# EAGLE schematic CPU (EAGLE 8.2.1)
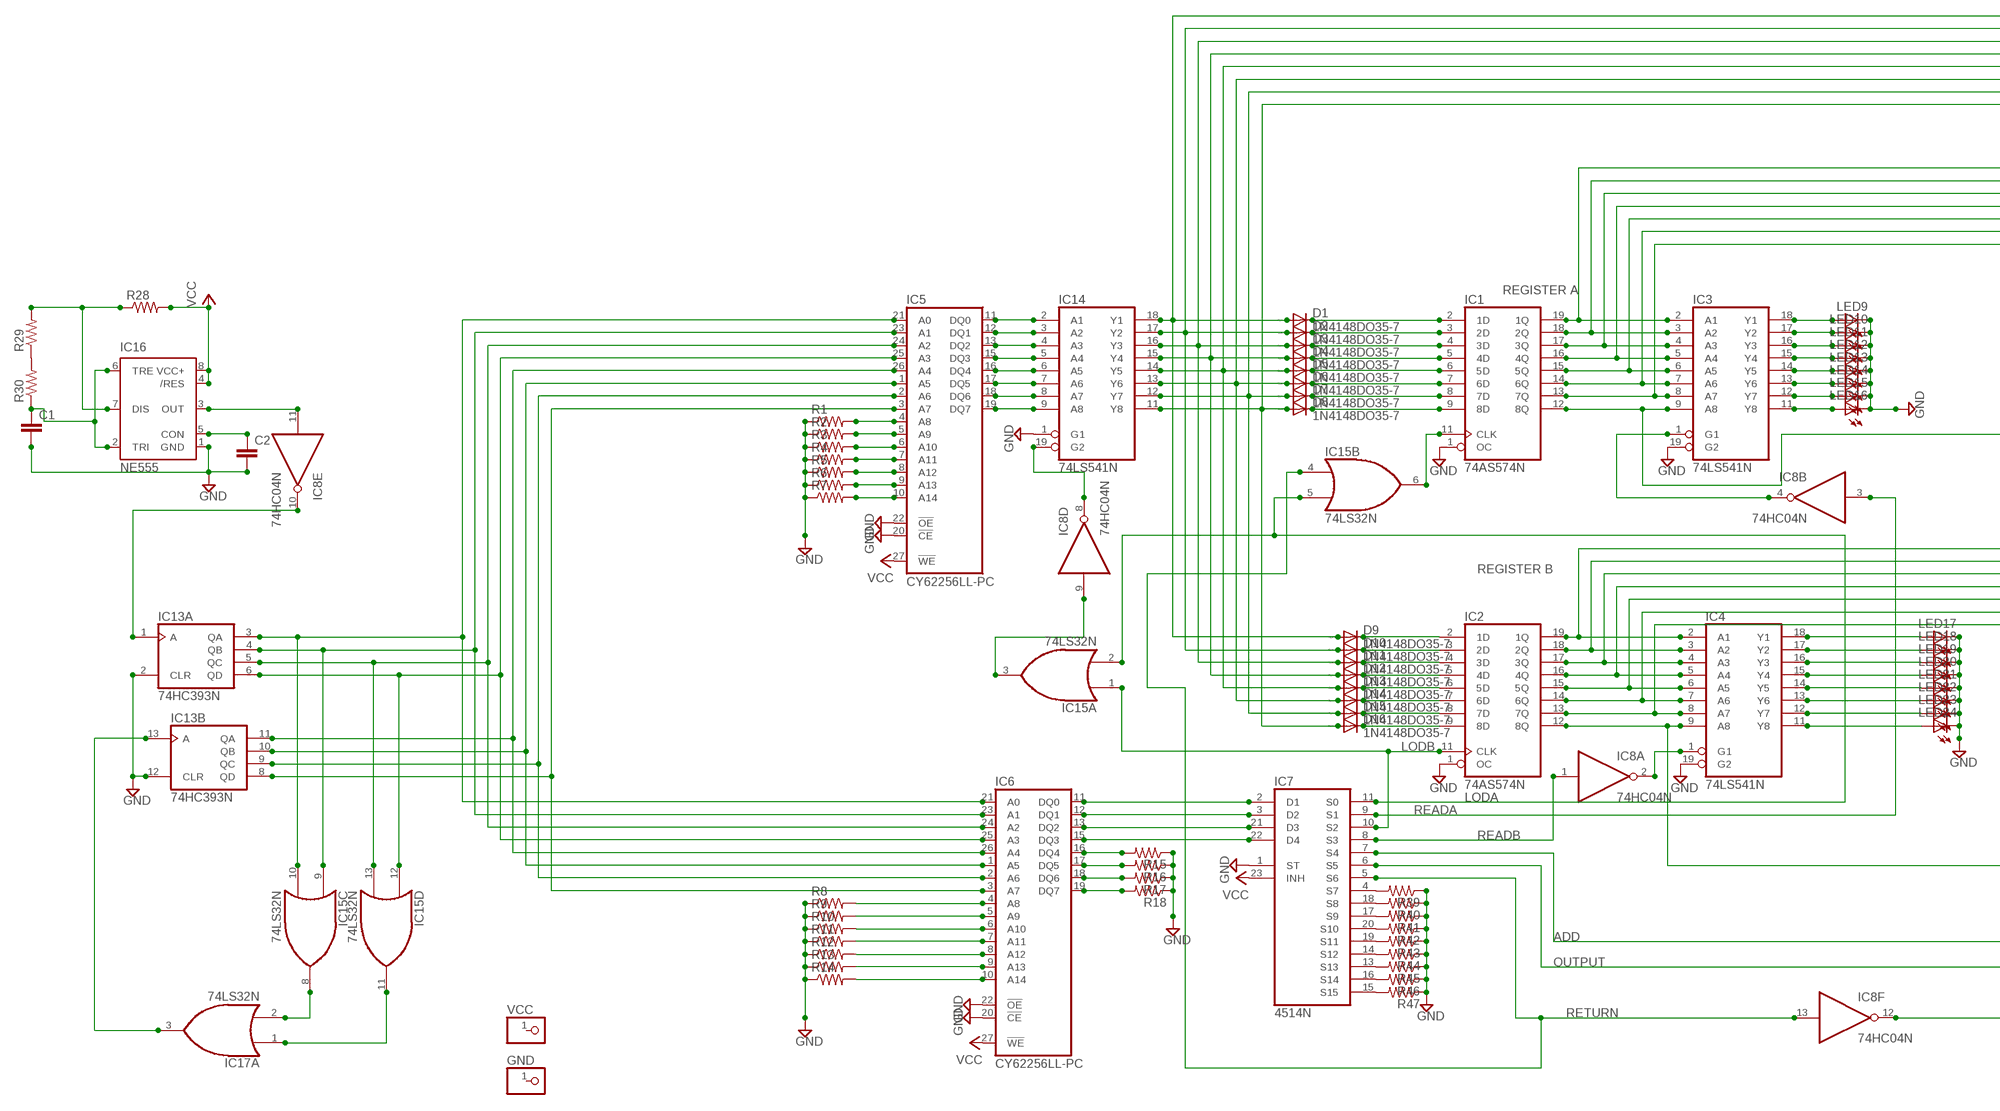
[diagram p0: schematic, sheet 1, part 1 of 2]
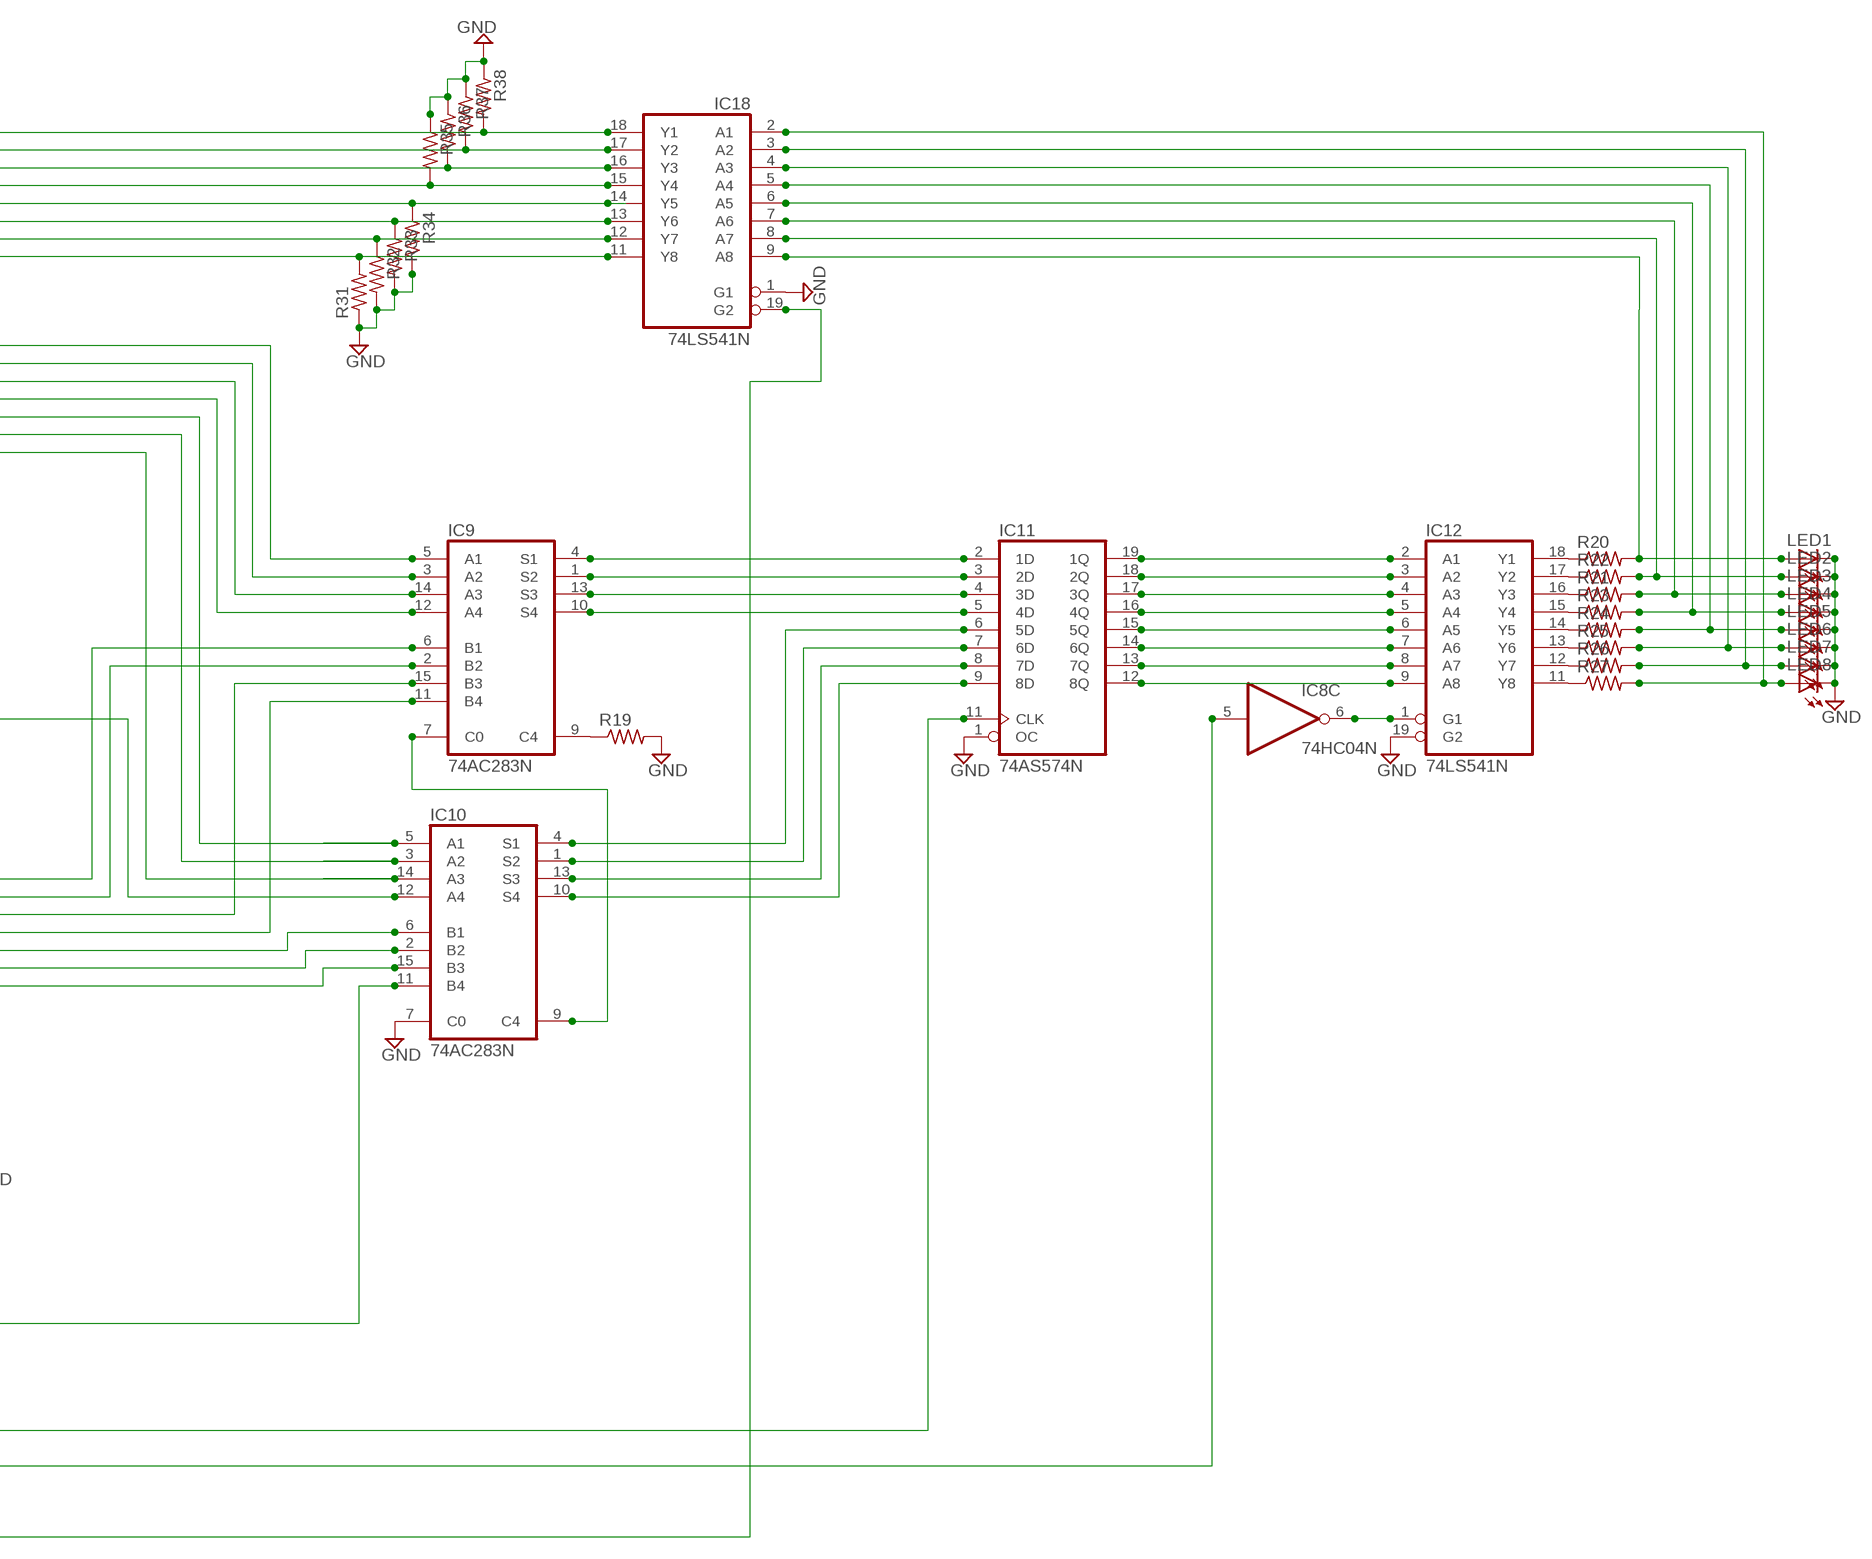
[diagram p1: schematic, sheet 1, part 2 of 2]

## Parts
C1  C2,5-3  [C2.5-3]
C2  C2,5-3  [C2.5-3]
D1  1N4148DO35-7  [DO35-7]
D2  1N4148DO35-7  [DO35-7]
D3  1N4148DO35-7  [DO35-7]
D4  1N4148DO35-7  [DO35-7]
D5  1N4148DO35-7  [DO35-7]
D6  1N4148DO35-7  [DO35-7]
D7  1N4148DO35-7  [DO35-7]
D8  1N4148DO35-7  [DO35-7]
D9  1N4148DO35-7  [DO35-7]
D10  1N4148DO35-7  [DO35-7]
D11  1N4148DO35-7  [DO35-7]
D12  1N4148DO35-7  [DO35-7]
D13  1N4148DO35-7  [DO35-7]
D14  1N4148DO35-7  [DO35-7]
D15  1N4148DO35-7  [DO35-7]
D16  1N4148DO35-7  [DO35-7]
GND  PINHD-1X1  [1X01]
IC1  74AS574N  [DIL20]
IC2  74AS574N  [DIL20]
IC3  74LS541N  [DIL20]
IC4  74LS541N  [DIL20]
IC5  CY62256LL-PC  [DIL28-6]
IC6  CY62256LL-PC  [DIL28-6]
IC7  4514N  [DIL24-6]
IC8  74HC04N  [DIL14]
IC9  74AC283N  [DIL16]
IC10  74AC283N  [DIL16]
IC11  74AS574N  [DIL20]
IC12  74LS541N  [DIL20]
IC13  74HC393N  [DIL14]
IC14  74LS541N  [DIL20]
IC15  74LS32N  [DIL14]
IC16  NE555  [DIL-08]
IC17  74LS32N  [DIL14]
IC18  74LS541N  [DIL20]
LED1  LED3MM  [LED3MM]
LED2  LED3MM  [LED3MM]
LED3  LED3MM  [LED3MM]
LED4  LED3MM  [LED3MM]
LED5  LED3MM  [LED3MM]
LED6  LED3MM  [LED3MM]
LED7  LED3MM  [LED3MM]
LED8  LED3MM  [LED3MM]
LED9  LED3MM  [LED3MM]
LED10  LED3MM  [LED3MM]
LED11  LED3MM  [LED3MM]
LED12  LED3MM  [LED3MM]
LED13  LED3MM  [LED3MM]
LED14  LED3MM  [LED3MM]
LED15  LED3MM  [LED3MM]
LED16  LED3MM  [LED3MM]
LED17  LED3MM  [LED3MM]
LED18  LED3MM  [LED3MM]
LED19  LED3MM  [LED3MM]
LED20  LED3MM  [LED3MM]
LED21  LED3MM  [LED3MM]
LED22  LED3MM  [LED3MM]
LED23  LED3MM  [LED3MM]
LED24  LED3MM  [LED3MM]
R1  R-US_MELF0102AX  [MINI_MELF-0102AX]
R2  R-US_MELF0102AX  [MINI_MELF-0102AX]
R3  R-US_MELF0102AX  [MINI_MELF-0102AX]
R4  R-US_MELF0102AX  [MINI_MELF-0102AX]
R5  R-US_MELF0102AX  [MINI_MELF-0102AX]
R6  R-US_MELF0102AX  [MINI_MELF-0102AX]
R7  R-US_MELF0102AX  [MINI_MELF-0102AX]
R8  R-US_MELF0102AX  [MINI_MELF-0102AX]
R9  R-US_MELF0102AX  [MINI_MELF-0102AX]
R10  R-US_MELF0102AX  [MINI_MELF-0102AX]
R11  R-US_MELF0102AX  [MINI_MELF-0102AX]
R12  R-US_MELF0102AX  [MINI_MELF-0102AX]
R13  R-US_MELF0102AX  [MINI_MELF-0102AX]
R14  R-US_MELF0102AX  [MINI_MELF-0102AX]
R15  R-US_MELF0102AX  [MINI_MELF-0102AX]
R16  R-US_MELF0102AX  [MINI_MELF-0102AX]
R17  R-US_MELF0102AX  [MINI_MELF-0102AX]
R18  R-US_MELF0102AX  [MINI_MELF-0102AX]
R19  R-US_MELF0102AX  [MINI_MELF-0102AX]
R20  R-US_MELF0102AX  [MINI_MELF-0102AX]
R21  R-US_MELF0102AX  [MINI_MELF-0102AX]
R22  R-US_MELF0102AX  [MINI_MELF-0102AX]
R23  R-US_MELF0102AX  [MINI_MELF-0102AX]
R24  R-US_MELF0102AX  [MINI_MELF-0102AX]
R25  R-US_MELF0102AX  [MINI_MELF-0102AX]
R26  R-US_MELF0102AX  [MINI_MELF-0102AX]
R27  R-US_MELF0102AX  [MINI_MELF-0102AX]
R28  R-US_MELF0102AX  [MINI_MELF-0102AX]
R29  R-US_MELF0102AX  [MINI_MELF-0102AX]
R30  R-US_MELF0102AX  [MINI_MELF-0102AX]
R31  R-US_MELF0102AX  [MINI_MELF-0102AX]
R32  R-US_MELF0102AX  [MINI_MELF-0102AX]
R33  R-US_MELF0102AX  [MINI_MELF-0102AX]
R34  R-US_MELF0102AX  [MINI_MELF-0102AX]
R35  R-US_MELF0102AX  [MINI_MELF-0102AX]
R36  R-US_MELF0102AX  [MINI_MELF-0102AX]
R37  R-US_MELF0102AX  [MINI_MELF-0102AX]
R38  R-US_MELF0102AX  [MINI_MELF-0102AX]
R39  R-US_MELF0102AX  [MINI_MELF-0102AX]
R40  R-US_MELF0102AX  [MINI_MELF-0102AX]
R41  R-US_MELF0102AX  [MINI_MELF-0102AX]
R42  R-US_MELF0102AX  [MINI_MELF-0102AX]
R43  R-US_MELF0102AX  [MINI_MELF-0102AX]
R44  R-US_MELF0102AX  [MINI_MELF-0102AX]
R45  R-US_MELF0102AX  [MINI_MELF-0102AX]
R46  R-US_MELF0102AX  [MINI_MELF-0102AX]
R47  R-US_MELF0102AX  [MINI_MELF-0102AX]
VCC  PINHD-1X1  [1X01]

## Nets
GND: C1.2 C2.2 IC1.1(OC) IC2.1(OC) IC3.19(G2) IC4.19(G2) IC5.20(!CE) IC5.22(!OE) IC6.20(!CE) IC6.22(!OE) IC7.1(ST) IC10.7(C0) IC11.1(OC) IC12.19(G2) IC13.2(A:CLR) IC13.12(B:CLR) IC14.1(G1) IC16.1(GND) IC18.1(G1) LED1.K(C) LED2.K(C) LED3.K(C) LED4.K(C) LED5.K(C) LED6.K(C) LED7.K(C) LED8.K(C) LED9.K(C) LED10.K(C) LED11.K(C) LED12.K(C) LED13.K(C) LED14.K(C) LED15.K(C) LED16.K(C) LED17.K(C) LED18.K(C) LED19.K(C) LED20.K(C) LED21.K(C) LED22.K(C) LED23.K(C) LED24.K(C) R1.1 R2.1 R3.1 R4.1 R5.1 R6.1 R7.1 R8.1 R9.1 R10.1 R11.1 R12.1 R13.1 R14.1 R15.1 R16.1 R17.1 R18.1 R19.2 R31.1 R32.2 R33.2 R34.2 R35.1 R36.1 R37.1 R38.1 R39.1 R40.1 R41.1 R42.1 R43.1 R44.1 R45.1 R46.1 R47.1
N$1: IC1.19(1Q) IC3.2(A1) IC9.5(A1)
N$2: IC1.18(2Q) IC3.3(A2) IC9.3(A2)
N$3: IC1.17(3Q) IC3.4(A3) IC9.14(A3)
N$4: IC1.16(4Q) IC3.5(A4) IC9.12(A4)
N$5: IC1.15(5Q) IC3.6(A5) IC10.5(A1)
N$6: IC1.14(6Q) IC3.7(A6) IC10.3(A2)
N$7: IC1.13(7Q) IC3.8(A7) IC10.14(A3)
N$8: IC2.19(1Q) IC4.2(A1) IC9.6(B1)
N$9: IC2.18(2Q) IC4.3(A2) IC9.2(B2)
N$10: IC2.17(3Q) IC4.4(A3) IC9.15(B3)
N$11: IC2.16(4Q) IC4.5(A4) IC9.11(B4)
N$12: IC2.15(5Q) IC4.6(A5) IC10.6(B1)
N$13: IC2.14(6Q) IC4.7(A6) IC10.2(B2)
N$14: IC2.13(7Q) IC4.8(A7) IC10.15(B3)
N$15: IC2.12(8Q) IC4.9(A8) IC10.11(B4)
N$16: IC1.12(8Q) IC3.9(A8) IC10.12(A4)
N$17: IC5.1(A5) IC6.1(A5) IC13.10(B:QB)
N$18: C2.1 IC16.5(CON)
N$19: IC5.23(A1) IC6.23(A1) IC13.4(A:QB) IC15.9(C:I0)
N$20: IC5.24(A2) IC6.24(A2) IC13.5(A:QC) IC15.13(D:I1)
N$21: IC5.25(A3) IC6.25(A3) IC13.6(A:QD) IC15.12(D:I0)
N$22: IC5.26(A4) IC6.26(A4) IC13.11(B:QA)
N$23: IC5.2(A6) IC6.2(A6) IC13.9(B:QC)
N$24: IC5.3(A7) IC6.3(A7) IC13.8(B:QD)
N$25: IC5.11(DQ0) IC14.2(A1)
N$26: IC5.12(DQ1) IC14.3(A2)
N$27: IC5.13(DQ2) IC14.4(A3)
N$28: IC5.15(DQ3) IC14.5(A4)
N$29: IC5.16(DQ4) IC14.6(A5)
N$30: IC5.17(DQ5) IC14.7(A6)
N$31: IC5.18(DQ6) IC14.8(A7)
N$32: IC5.19(DQ7) IC14.9(A8)
N$33: IC5.4(A8) R1.2
N$34: IC5.5(A9) R2.2
N$35: IC5.6(A10) R3.2
N$36: IC5.7(A11) R4.2
N$37: IC5.8(A12) R5.2
N$38: IC5.9(A13) R6.2
N$39: IC5.10(A14) R7.2
N$40: IC6.11(DQ0) IC7.2(D1)
N$41: IC6.4(A8) R8.2
N$42: IC6.5(A9) R9.2
N$43: IC6.6(A10) R10.2
N$44: IC6.7(A11) R11.2
N$45: IC6.8(A12) R12.2
N$46: IC6.9(A13) R13.2
N$47: IC6.10(A14) R14.2
N$48: IC6.12(DQ1) IC7.3(D2)
N$49: IC6.13(DQ2) IC7.21(D3)
N$50: IC6.15(DQ3) IC7.22(D4)
N$51: IC6.16(DQ4) R15.2
N$52: IC6.17(DQ5) R16.2
N$53: IC6.18(DQ6) R17.2
N$54: IC6.19(DQ7) R18.2
N$55: D9.C IC2.2(1D)
N$56: D10.C IC2.3(2D)
N$57: D11.C IC2.4(3D)
N$58: D12.C IC2.5(4D)
N$59: D13.C IC2.6(5D)
N$60: D14.C IC2.7(6D)
N$61: D15.C IC2.8(7D)
N$62: IC5.21(A0) IC6.21(A0) IC13.3(A:QA) IC15.10(C:I1)
N$63: IC7.7(S4) IC11.11(CLK)
N$64: IC2.11(CLK) IC7.10(S2) IC15.1(A:I0)
N$65: IC7.11(S0) IC15.2(A:I1) IC15.5(B:I1)
N$66: IC7.9(S1) IC8.3(B:I)
N$67: IC3.1(G1) IC8.4(B:O)
N$68: IC4.1(G1) IC8.2(A:O)
N$69: IC7.8(S3) IC8.1(A:I)
N$70: IC9.7(C0) IC10.9(C4)
N$71: IC9.9(C4) R19.1
N$72: IC9.4(S1) IC11.2(1D)
N$73: IC9.1(S2) IC11.3(2D)
N$74: IC9.13(S3) IC11.4(3D)
N$75: IC9.10(S4) IC11.5(4D)
N$76: IC10.4(S1) IC11.6(5D)
N$77: IC10.1(S2) IC11.7(6D)
N$78: IC10.13(S3) IC11.8(7D)
N$79: IC10.10(S4) IC11.9(8D)
N$80: IC11.19(1Q) IC12.2(A1)
N$81: IC11.18(2Q) IC12.3(A2)
N$82: IC11.17(3Q) IC12.4(A3)
N$83: IC11.16(4Q) IC12.5(A4)
N$84: IC11.15(5Q) IC12.6(A5)
N$85: IC11.14(6Q) IC12.7(A6)
N$86: IC11.13(7Q) IC12.8(A7)
N$87: IC11.12(8Q) IC12.9(A8)
N$88: IC12.18(Y1) R20.1
N$89: IC12.16(Y3) R21.1
N$90: IC12.17(Y2) R22.1
N$91: IC12.15(Y4) R23.1
N$92: IC12.14(Y5) R24.1
N$93: IC12.13(Y6) R25.1
N$94: IC12.12(Y7) R26.1
N$95: IC12.11(Y8) R27.1
N$96: D8.A D16.A IC14.11(Y8) IC18.11(Y8) R31.2
N$97: IC18.5(A4) LED5.A R24.2
N$98: IC18.3(A2) LED7.A R26.2
N$99: IC18.2(A1) LED8.A R27.2
N$100: IC18.4(A3) LED6.A R25.2
N$101: IC18.6(A5) LED4.A R23.2
N$102: IC18.7(A6) LED3.A R21.2
N$103: IC18.9(A8) LED1.A R20.2
N$104: IC7.6(S5) IC8.5(C:I)
N$105: IC8.6(C:O) IC12.1(G1)
N$106: D16.C IC2.9(8D)
N$107: D3.A D11.A IC14.16(Y3) IC18.16(Y3) R36.2
N$108: D1.A D9.A IC14.18(Y1) IC18.18(Y1) R38.2
N$109: D4.A D12.A IC14.15(Y4) IC18.15(Y4) R35.2
N$110: D6.A D14.A IC14.13(Y6) IC18.13(Y6) R33.1
N$111: D7.A D15.A IC14.12(Y7) IC18.12(Y7) R32.1
N$112: IC18.8(A7) LED2.A R22.2
N$113: D5.A D13.A IC14.14(Y5) IC18.14(Y5) R34.1
N$114: D2.A D10.A IC14.17(Y2) IC18.17(Y2) R37.2
N$115: IC8.9(D:I) IC15.3(A:O)
N$116: D1.C IC1.2(1D)
N$117: D2.C IC1.3(2D)
N$118: D3.C IC1.4(3D)
N$119: D4.C IC1.5(4D)
N$120: D5.C IC1.6(5D)
N$121: D6.C IC1.7(6D)
N$122: D7.C IC1.8(7D)
N$123: D8.C IC1.9(8D)
N$124: IC8.8(D:O) IC14.19(G2)
N$125: R29.1 R30.2
N$126: IC16.7(DIS) R28.1 R29.2
N$127: C1.1 IC16.2(TRI) IC16.6(TRE) R30.1
N$128: IC8.10(E:O) IC13.1(A:A)
N$129: IC8.12(F:O) IC18.19(G2)
N$130: IC8.11(E:I) IC16.3(OUT)
N$131: IC1.11(CLK) IC15.6(B:O)
N$132: IC7.5(S6) IC8.13(F:I) IC15.4(B:I0)
N$133: IC3.18(Y1) LED9.A
N$134: IC3.17(Y2) LED10.A
N$135: IC3.16(Y3) LED11.A
N$136: IC3.15(Y4) LED12.A
N$137: IC3.14(Y5) LED13.A
N$138: IC3.13(Y6) LED14.A
N$139: IC3.12(Y7) LED15.A
N$140: IC3.11(Y8) LED16.A
N$141: IC4.18(Y1) LED17.A
N$142: IC4.17(Y2) LED18.A
N$143: IC4.16(Y3) LED19.A
N$144: IC4.15(Y4) LED20.A
N$145: IC4.14(Y5) LED21.A
N$146: IC4.13(Y6) LED22.A
N$147: IC4.12(Y7) LED23.A
N$148: IC4.11(Y8) LED24.A
N$149: IC7.4(S7) R39.2
N$150: IC7.18(S8) R40.2
N$151: IC7.17(S9) R41.2
N$152: IC7.20(S10) R42.2
N$153: IC7.19(S11) R43.2
N$154: IC7.14(S12) R44.2
N$155: IC7.13(S13) R45.2
N$156: IC7.16(S14) R46.2
N$157: IC7.15(S15) R47.2
N$158: IC15.8(C:O) IC17.2(A:I1)
N$159: IC15.11(D:O) IC17.1(A:I0)
N$160: IC13.13(B:A) IC17.3(A:O)
VCC: IC5.27(!WE) IC6.27(!WE) IC7.23(INH) IC16.4(/RES) IC16.8(VCC+) R28.2
Unconnected: GND.1 IC17.4(B:I0) IC17.5(B:I1) IC17.6(B:O) IC17.8(C:O) IC17.9(C:I0) IC17.10(C:I1) IC17.11(D:O) IC17.12(D:I0) IC17.13(D:I1) VCC.1

## Notes on the sheet
- REGISTER A
- REGISTER B
- LODB
- LODA
- READA
- READB
- ADD
- OUTPUT
- RETURN

## Power pins joined to a net without a drawn wire
GND: IC1.10(GND) IC2.10(GND) IC3.10(GND) IC4.10(GND) IC5.14(GND) IC6.14(GND) IC8.7(P:GND) IC9.8(GND) IC10.8(GND) IC11.10(GND) IC12.10(GND) IC13.7(P:GND) IC14.10(GND) IC15.7(P:GND) IC17.7(P:GND) IC18.10(GND)
VCC: IC1.20(VCC) IC2.20(VCC) IC3.20(VCC) IC4.20(VCC) IC5.28(VCC) IC6.28(VCC) IC8.14(P:VCC) IC9.16(VCC) IC10.16(VCC) IC11.20(VCC) IC12.20(VCC) IC13.14(P:VCC) IC14.20(VCC) IC15.14(P:VCC) IC17.14(P:VCC) IC18.20(VCC)
VDD: IC7.24(VDD)
VSS: IC7.12(VSS)

## Library data of the parts
C1 C2 = capacitor-wima:C: CAPACITOR naming: grid - package width
D1-D16 = diode:1N4148: DIODE high speed (Philips)
GND VCC = pinhead:PINHD-1X1: PIN HEADER
IC1 IC2 IC11 = 74xx-us:74*574: 8-bit D type FLIP FLOP bus driver
IC3 IC4 IC12 IC14 IC18 = 74xx-us:74*541: Octal BUFFER and LINE DRIVER, 3-state
IC5 IC6 = memory-sram:CY62256LL-?*: 256K (32K x 8) CMOS-Static RAM Source: http://download.cypress.com.edgesuite.net/design_resources/datasheets/contents/cy62256_8.pdf
IC7 = 45xx:4514: 4-bit latch 4-16 line DECODER
IC8 = 74xx-eu:74*04: Hex INVERTER
IC9 IC10 = 74xx-eu:74*283: 4-bit binary FULL ADDER, fast carry
IC13 = 74xx-eu:74*393: Dual 4-bit decade and binary COUNTER
IC15 IC17 = 74xx-us:74*32: Quad 2-input OR gate
IC16 = st-microelectronics:NE555: General purpose bipolar Timer; MF: Arrow Electronics; MPN: NE555N; OC_FARNELL: 1467742; OC_NEWARK: 89K1486
LED1-LED24 = led:LED: LED OSRAM: - CHIPLED LG R971, LG N971, LY N971, LG Q971, LY Q971, LO R971, LY R971 LH N974, LH R974 LS Q976, LO Q976, LY Q976 LO Q996 - Hyper CHIPLED LW Q18S LB Q993, LB Q99A, LB R99A - SideLED LS A670, LO A670, LY A670, LG A670, LP A670 LB A673, LV A673, LT A673, LW A673 LH A674 LY A675 LS A676, LA A676, LO A676, LY A676, LW A676 LS A679, LY A679, LG A679 - Hyper Micro SIDELED® LS Y876, LA Y876, LO Y876, LY Y876 LT Y87S - SmartLED LW L88C, LW L88S LB L89C, LB L89S, LG L890 LS L89K, LO L89K, LY L89K LS L896, LA L896, LO L896, LY L896 - TOPLED LS T670, LO T670, LY T670, LG T670, LP T670 LSG T670, LSP T670, LSY T670, LOP T670, LYG T670 LG T671, LOG T671, LSG T671 LB T673, LV T673, LT T673, LW T673 LH T674 LS T676, LA T676, LO T676, LY T676, LB T676, LH T676, LSB T676, LW T676 LB T67C, LV T67C, LT T67C, LS T67K, LO T67K, LY T67K, LW E67C LS E67B, LA E67B, LO E67B, LY E67B, LB E67C, LV E67C, LT E67C LW T67C LS T679, LY T679, LG T679 LS T770, LO T770, LY T770, LG T770, LP T770 LB T773, LV T773, LT T773, LW T773 LH T774 LS E675, LA E675, LY E675, LS T675 LS T776, LA T776, LO T776, LY T776, LB T776 LHGB T686 LT T68C, LB T68C - Hyper Mini TOPLED® LB M676 - Mini TOPLED Santana® LG M470 LS M47K, LO M47K, LY M47K Source: http://www.osram.convergy.de LUXEON: - LUMILED® LXK2-PW12-R00, LXK2-PW12-S00, LXK2-PW14-U00, LXK2-PW14-V00 LXK2-PM12-R00, LXK2-PM12-S00, LXK2-PM14-U00 LXK2-PE12-Q00, LXK2-PE12-R00, LXK2-PE12-S00, LXK2-PE14-T00, LXK2-PE14-U00 LXK2-PB12-K00, LXK2-PB12-L00, LXK2-PB12-M00, LXK2-PB14-N00, LXK2-PB14-P00, LXK2-PB14-Q00 LXK2-PR12-L00, LXK2-PR12-M00, LXK2-PR14-Q00, LXK2-PR14-R00 LXK2-PD12-Q00, LXK2-PD12-R00, LXK2-PD12-S00 LXK2-PH12-R00, LXK2-PH12-S00 LXK2-PL12-P00, LXK2-PL12-Q00, LXK2-PL12-R00 Source: www.luxeon.com KINGBRIGHT: KA-3528ASYC Source: www.kingbright.com
R1-R47 = rcl:R-US_: RESISTOR, American symbol